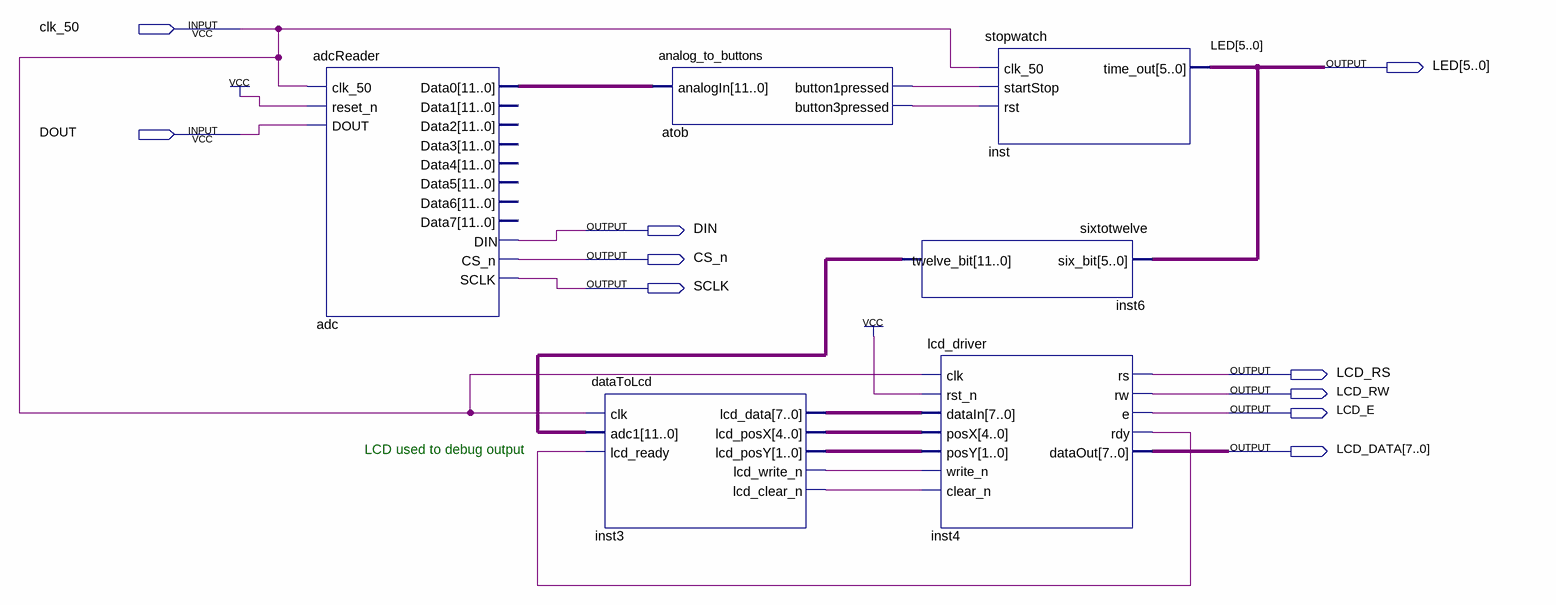
[diagram p0: schematic sheet]
// Quartus schematic Teil3.bdf as structural Verilog: 6 symbols, 10 pins
module Teil3 (
  input  clk_50,
  input  DOUT,
  output [5:0] LED,
  output DIN,
  output CS_n,
  output SCLK,
  output LCD_RS,
  output LCD_RW,
  output LCD_E,
  output [7:0] LCD_DATA
);

  wire atob_button1pressed, atob_button3pressed, inst3_lcd_clear_n, inst3_lcd_write_n, inst4_rdy;
  wire [1:0] inst3_lcd_posy;
  wire [4:0] inst3_lcd_posx;
  wire [7:0] inst3_lcd_data;
  wire [11:0] adc_data0, inst6_twelve_bit;

  adcReader adc (
    .clk_50(clk_50), .reset_n(1'b1), .DOUT(DOUT), .Data0(adc_data0), .DIN(DIN), .CS_n(CS_n), .SCLK(SCLK));  // open: Data1, Data2, Data3, Data4, Data5, Data6, Data7
  dataToLcd inst3 (
    .clk(clk_50), .adc1(inst6_twelve_bit), .lcd_ready(inst4_rdy), .lcd_data(inst3_lcd_data),
    .lcd_posX(inst3_lcd_posx), .lcd_posY(inst3_lcd_posy), .lcd_write_n(inst3_lcd_write_n),
    .lcd_clear_n(inst3_lcd_clear_n));
  analog_to_buttons atob (
    .analogIn(adc_data0), .button1pressed(atob_button1pressed), .button3pressed(atob_button3pressed));
  sixtotwelve inst6 (.six_bit(LED), .twelve_bit(inst6_twelve_bit));
  stopwatch inst (.clk_50(clk_50), .startStop(atob_button1pressed), .rst(atob_button3pressed), .time_out(LED));
  lcd_driver inst4 (
    .clk(clk_50), .rst_n(1'b1), .dataIn(inst3_lcd_data), .posX(inst3_lcd_posx), .posY(inst3_lcd_posy),
    .write_n(inst3_lcd_write_n), .clear_n(inst3_lcd_clear_n), .rs(LCD_RS), .rw(LCD_RW), .e(LCD_E),
    .rdy(inst4_rdy), .dataOut(LCD_DATA));

  // Notes on the sheet:
  //   LCD used to debug output
endmodule
